# Altium project OnePhaseController.PrjPcb
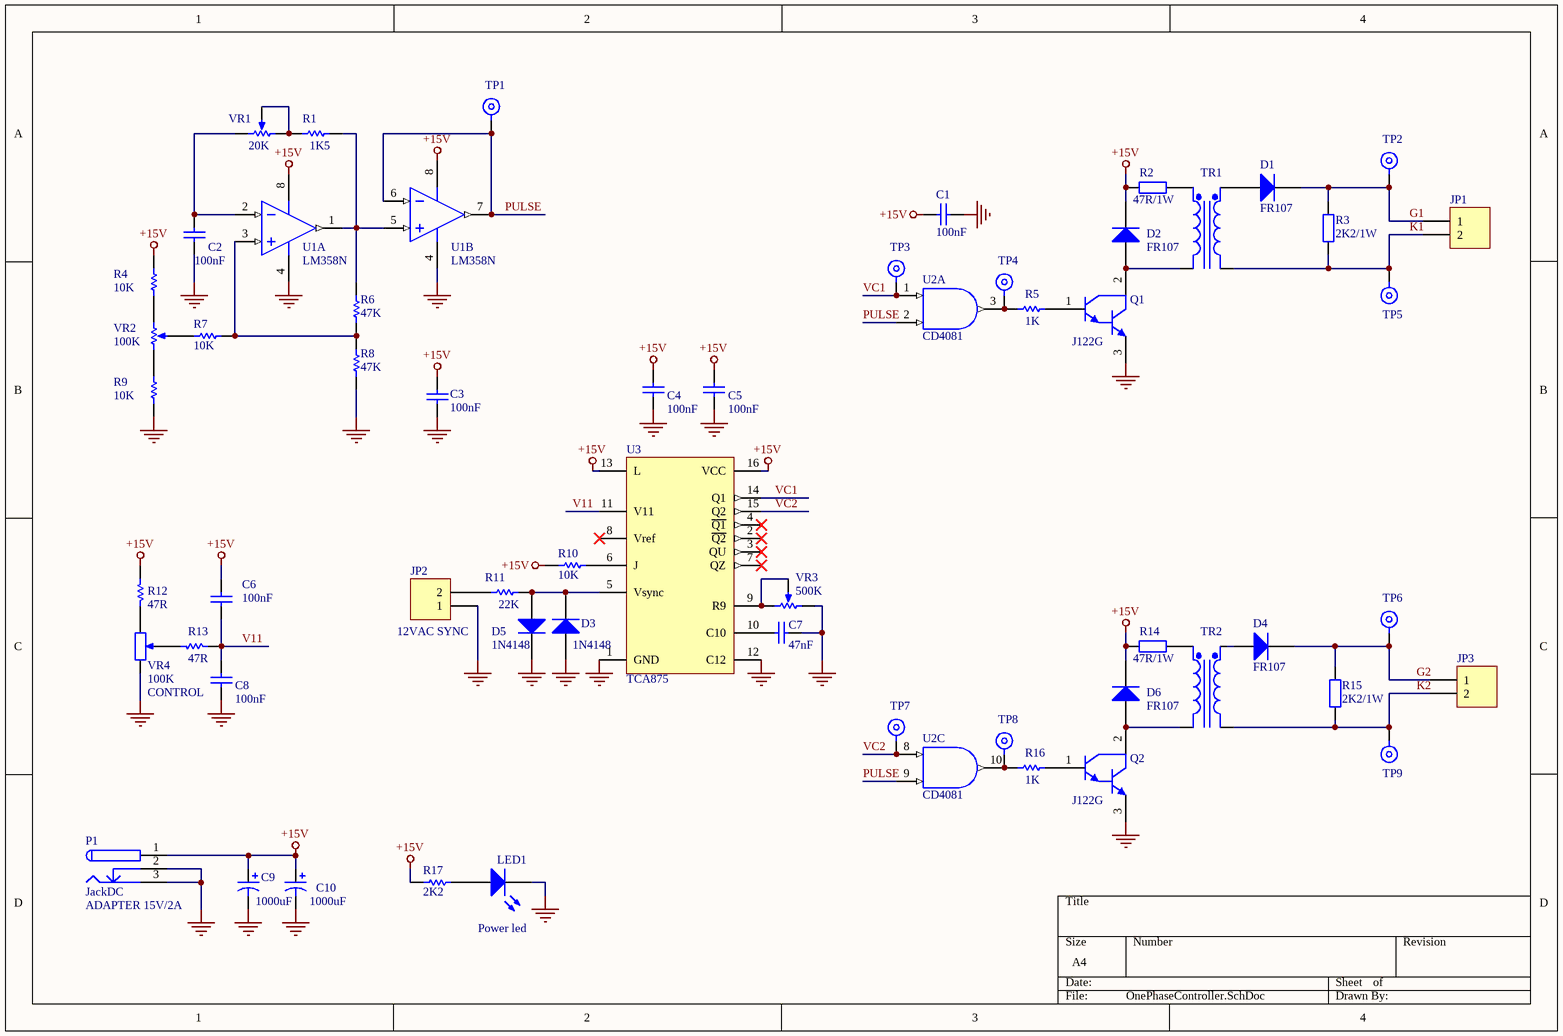
[diagram p0: OnePhaseController.SchDoc]
1 sheet, 58 parts. Net scope: global (net labels, ports and power ports of the same name join across sheets).
Board file: OnePhaseController.PcbDoc

## Sheet OnePhaseController.SchDoc
size A4; PageSetup: Record=PageOptions|CenterHorizontal=True|CenterVertical=True|PrintScale=0.71|XCorrection=1.00|YCorrection=1.00|PrintKind=0|BorderSize=5000000|LeftOffset=0|BottomOffset=0|Orientation=2|PaperLength=1000|PaperWidth=1000|Scale=100|PaperSource=7|PrintQuality=-4|MediaType=1|DitherType=10|PaperKind=A4|PrintScaleMode=1

### Parts
C1  value 100nF  [C-0805]  (hidden comment: 104)
C2  value 100nF  [C-0805]  (hidden comment: 104)
C3  value 100nF  [C-0805]  (hidden comment: 104)
C4  value 100nF  [C-0805]  (hidden comment: 104)
C5  value 100nF  [C-0805]  (hidden comment: 104)
C6  value 100nF  [C-0805]  (hidden comment: 104)
C7  value 47nF  [C-200]  (hidden comment: 473)
C8  value 100nF  [C-0805]  (hidden comment: 104)
C9  value 1000uF  [C-13x25mm]  (hidden comment: 1000uF/25V)
C10  value 1000uF  [C-13x25mm]  (hidden comment: 1000uF/25V)
D1  FR107  [D-DO214-AC(SMA)]
D2  FR107  [D-DO214-AC(SMA)]
D3  1N4148  [D-SOD-80]
D4  FR107  [D-DO214-AC(SMA)]
D5  1N4148  [D-SOD-80]
D6  FR107  [D-DO214-AC(SMA)]
JP1  KF301  [TER-KF301-2]  (value not drawn)
JP2  value 12VAC SYNC  [TER-KF301-2]  (hidden comment: KF301)
JP3  KF301  [TER-KF301-2]  (value not drawn)
LED1  value Power led  [LED-D5-2A]  (hidden comment: RED)
P1  JackDC  value ADAPTER 15V/2A  [TER-JACKDC-5.5x2.1mm]
Q1  J122G  [TO-252-3]
Q2  J122G  [TO-252-3]
R1  1K5  [R-0805]
R2  47R/1W  [R-1W-P200mil]
R3  2K2/1W  [R-1W-P200mil]
R4  10K  [R-0805]
R5  1K  [R-0805]
R6  47K  [R-0805]
R7  10K  [R-0805]
R8  47K  [R-0805]
R9  10K  [R-0805]
R10  10K  [R-0805]
R11  22K  [R-0805]
R12  47R  [R-0805]
R13  47R  [R-0805]
R14  47R/1W  [R-1W-P200mil]
R15  2K2/1W  [R-1W-P200mil]
R16  1K  [R-0805]
R17  2K2  [R-0805]
TP1  Testpoint  [TP1A]  (value not drawn)
TP2  Testpoint  [TP1A]  (value not drawn)
TP3  Testpoint  [TP1A]  (value not drawn)
TP4  Testpoint  [TP1A]  (value not drawn)
TP5  Testpoint  [TP1A]  (value not drawn)
TP6  Testpoint  [TP1A]  (value not drawn)
TP7  Testpoint  [TP1A]  (value not drawn)
TP8  Testpoint  [TP1A]  (value not drawn)
TP9  Testpoint  [TP1A]  (value not drawn)
TR1  BIENAPCACHLY  [TRANS-DRIVER-THYR]  (value not drawn)
TR2  BIENAPCACHLY  [TRANS-DRIVER-THYR]  (value not drawn)
U1  LM358N  [SOP-8]  (parts A,B of 2)
U2  value CD4081  [SOP-14]  (hidden comment: HCF4081BM1)  (parts A,C of 4)
U3  TCA875  [SK-DIP16-300]
VR1  20K  [VR-3296W]
VR2  100K  [VR-3296W]
VR3  500K  [VR-3296W]
VR4  Note: CONTROL  [TER-KF301-3]  (hidden comment: 100K)

### Nets
+15V: C1.2 C3.2 C4.2 C5.2 C6.2 C9.1 C10.1 D2.2(K) D6.2(K) P1.1(VCC) R2.1 R4.2 R10.2 R12.2 R14.1 R17.1 U1.8(V+) U2.14(VCC) U3.13(L) U3.16(VCC)
GND: C1.1 C2.2 C3.1 C4.1 C5.1 C7.2 C8.1 C9.2 C10.2 D3.1(A) D5.2(K) JP2.1 LED1.2(K) P1.2(TAB) P1.3(VSS) Q1.3(E) Q2.3(E) R8.2 R9.1 U1.4(GND) U2.7(GND) U3.1(GND) U3.12(C12) VR3.1(TOP) VR4.3(TOP)
G1: D1.2(K) JP1.1 R3.1 TP2.1
G2: D4.2(K) JP3.1 R15.1 TP6.1
K1: JP1.2 R3.2 TP5.1 TR1.3(Sec-)
K2: JP3.2 R15.2 TP9.1 TR2.3(Sec-)
PULSE: TP1.1 U1.6(IN-) U1.7(OUT) U2.2(B) U2.9(F)
V11: C6.1 C8.2 R13.1 U3.11(V11)
VC1: TP3.1 U2.1(A) U3.14(Q1)
VC2: TP7.1 U2.8(E) U3.15(Q2)
NetC2_1: C2.1 U1.2(IN-) VR1.3(TAP)
NetC7_1: C7.1 U3.10(C10)
NetD1_1: D1.1(A) TR1.4(Sec+)
NetD2_1: D2.1(A) Q1.2(C) TR1.2(Pri-)
NetD3_2: D3.2(K) D5.1(A) R11.1 U3.5(Vsync)
NetD4_1: D4.1(A) TR2.4(Sec+)
NetD6_1: D6.1(A) Q2.2(C) TR2.2(Pri-)
NetJP2_2: JP2.2 R11.2
NetLED1_1: LED1.1(A) R17.2
NetQ1_1: Q1.1(B) R5.1
NetQ2_1: Q2.1(B) R16.1
NetR1_1: R1.1 R6.1 U1.1(OUT) U1.5(IN+)
NetR1_2: R1.2 VR1.1(TOP) VR1.2(BOT)
NetR2_2: R2.2 TR1.1(Pri+)
NetR4_1: R4.1 VR2.3(TAP)
NetR5_2: R5.2 TP4.1 U2.3(J)
NetR6_2: R6.2 R7.1 R8.1 U1.3(IN+)
NetR7_2: R7.2 VR2.2(BOT)
NetR9_2: R9.2 VR2.1(TOP)
NetR10_1: R10.1 U3.6(J)
NetR12_1: R12.1 VR4.1(BOT)
NetR13_2: R13.2 VR4.2(TAP)
NetR14_2: R14.2 TR2.1(Pri+)
NetR16_2: R16.2 TP8.1 U2.10(L)
NetU3_9: U3.9(R9) VR3.2(BOT) VR3.3(TAP)

Not connected (* = marked no-connect by the designer): U3 2(~{Q2})* 3(QU)* 4(~{Q1})* 7(QZ)* 8(Vref)*

### Library data of the parts
C1 C3-C6 C8 = Cap: Capacitor; Published: 8-Jun-2000; LatestRevisionDate: 17-Jul-2002; LatestRevisionNote: Re-released for DXP Platform.; PackageReference: RAD-0.3; Publisher: Altium Limited
C2 C7 = Cap: Capacitor; Manufacturer: Generic Components; Class: Passive; Published: 08/06/2000; Publisher: Altium Hobart Technology Centre; SubClass: Capacitor
C9 C10 = Cap Pol1: Polarized Capacitor (Radial); Published: 8-Jun-2000; LatestRevisionDate: 17-Jul-2002; LatestRevisionNote: Re-released for DXP Platform.; PackageReference: RB7.6-15; Publisher: Altium Limited
D1-D6 = Diode: Default Diode; Manufacturer: Generic Components; Class: Discrete; SubClass: Diode - Switching; Published: 08/06/2000; Publisher: Altium Hobart Technology Centre
  D1 D2 D4 D6: Value: FR107
  D3 D5: Value: 1N4148
JP1-JP3 = Header 2: Header, 2-Pin; Manufacturer: Generic Components; Class: Connector
  JP1 JP3: Value: Header 2
LED1 = LED1: Typical RED GaAs LED; Published: 8-Jun-2000; LatestRevisionDate: 08-Jul-2005; LatestRevisionNote: Mech Layer 1 removed.; PackageReference: LED-1; Publisher: Altium Limited
P1 = JackDC: Low Voltage Power Supply Connector; Published: 17-Dec-2003; DatasheetDocument: 09-May-2002; ComponentLink1Description: Manufacturer Link; ComponentLink1URL: http://domino.kycon.com/internet/Products.html
Q1 Q2 = NPN1: NPN Darlington Bipolar Transistor; Published: 8-Jun-2000; LatestRevisionDate: 17-Jul-2002; LatestRevisionNote: Re-released for DXP Platform.; DatasheetVersion: 1989; PackageVersion: 1989; PackageReference: TO-92; Value: J122G; PackageDescription: TO, Flat Index; 3 In-Line, Axial Leads; Body Dia. 4.6mm; Leads 0.41 x 0.39 mm (max); Code_JEDEC: TO-92
R1 R4-R13 R16 R17 = Res1: Resistor; Published: 8-Jun-2000; LatestRevisionDate: 17-Jul-2002; LatestRevisionNote: Re-released for DXP Platform.; PackageReference: AXIAL-0.3; Publisher: Altium Limited
  R1: Value: 1K5
  R4 R7 R9 R10: Value: 10K
  R5 R16: Value: 1K
  R6 R8: Value: 47K
  R11: Value: 22K
  R12 R13: Value: 47R
  R17: Value: 2K2
R2 R3 R14 R15 = Res2: Resistor; Manufacturer: Generic Components; Class: Passive; Published: 08/06/2000; Publisher: Altium Hobart Technology Centre; SubClass: Resistor
  R2 R14: Value: 47R/1W
  R3 R15: Value: 2K2/1W
TP1-TP9 = TP1
TR1 TR2 = BIENAPCACHLY: value: TRANFORMER
U1 = LM358N: Low-Power Dual Operational Amplifier; Published: 15-Apr-2002; LatestRevisionDate: 06-Jun-2005; LatestRevisionNote: Stylized 3D Model Added.; DatasheetVersion: Sep-1999; PackageVersion: Sep-1997; PackageReference: N08E; Publisher: Altium Limited; PackageDescription: DIP; 8 Leads; Row Spacing 7.62 mm; Pitch 2.54 mm; ComponentLink1Description: Manufacturer Link; ComponentLink1URL: http://www.national.com/; ComponentLink2Description: Datasheet; ComponentLink2URL: http://www.national.com/ds.cgi/LM/LM158.pdf; ComponentLink3Description: URL Link1; ComponentLink3URL: http://www.national.com/pf/LM/LM358.html; value: LM358N
U2 = HCF4081BM1: Quad 2-Input AND-Gate; Manufacturer: ST-Microelectronics; Revised: 29-Sep-2000: Name of VCC pin changed to VDD; Class: Logic; SubClass: Gate; Published: 08/06/2000; Publisher: Altium Hobart Technology Centre
U3 = TCA785: Value: TCA875
VR1-VR3 = VR
  VR1: Value: 20K
  VR2: Value: 100K
  VR3: Value: 500K
VR4 = RPot2: Potentiometer; Manufacturer: Generic Components; Class: Passive; Set Position: 0.5; Published: 08/06/2000; Publisher: Altium Hobart Technology Centre; Value: 100K